# Altium schematic sheet MicroController.SchDoc
size A4; CompanyName: AUVIC; DrawnBy: Aman Nijjar; Organization: AUVIC; DocumentNumber: 2; Revision: 0; SheetNumber: 2; SheetTotal: 3; DocumentName: Pinger; ProjectName: Pinger
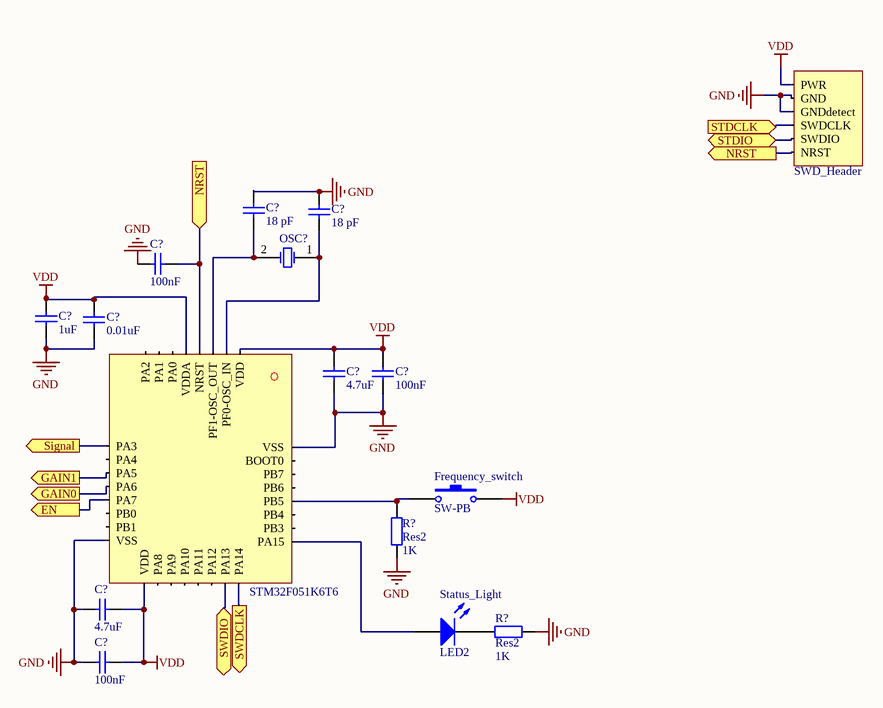
[diagram p0: MicroController.SchDoc]

## Parts
(Parts that share a designator on the sheet are numbered #1, #2 ... from top to bottom, then left to right.)
*?#1  SWD_Header  [Male_header]
*?#2  STM32F051K6T6  [TQFP68P900X900X160-32N]
C?#1  value 18 pF  [RAD-0.3]  (hidden comment: Cap)
C?#2  value 18 pF  [RAD-0.3]  (hidden comment: Cap)
C?#3  value 100nF  [RAD-0.3]  (hidden comment: Cap)
C?#4  value 1uF  [RAD-0.3]  (hidden comment: Cap)
C?#5  value 0.01uF  [RAD-0.3]  (hidden comment: Cap)
C?#6  value 4.7uF  [RAD-0.3]  (hidden comment: Cap)
C?#7  value 100nF  [RAD-0.3]  (hidden comment: Cap)
C?#8  value 4.7uF  [RAD-0.3]  (hidden comment: Cap)
C?#9  value 100nF  [RAD-0.3]  (hidden comment: Cap)
Frequency_switch  SW-PB  [SPST-2]
OSC?  ABMM2-14.7456MHZ-E2-T  [R38]  (value not drawn)
R?#1  Res2  value 1K  [AXIAL-0.4]
R?#2  Res2  value 1K  [AXIAL-0.4]
Status_Light  LED2  [3.2X1.6X1.1]

## Ports
EN (out), GAIN0 (out), GAIN1 (out), NRST (in), NRST (out), Signal (out), STDCLK (in), STDIO (bidir), SWDCLK (out), SWDIO (bidir)

## Nets
GND: *?#1.2(GND) *?#1.3(GNDdetect) *?#2.16(VSS) *?#2.32(VSS) C?#1.2 C?#2.2 C?#3.1 C?#4.2 C?#5.2 C?#6.2 C?#7.2 C?#8.2 C?#9.2 R?#1.2 R?#2.2
VDD: *?#1.1(PWR) *?#2.1(VDD) *?#2.5(VDDA) *?#2.17(VDD) C?#4.1 C?#5.1 C?#6.1 C?#7.1 C?#8.1 C?#9.1 Frequency_switch.2
EN: *?#2.13(PA7) ; port EN
GAIN0: *?#2.12(PA6) ; port GAIN0
GAIN1: *?#2.11(PA5) ; port GAIN1
NRST: *?#1.6(NRST) *?#2.4(NRST) C?#3.2 ; port NRST
Signal: *?#2.9(PA3) ; port Signal
STDCLK: *?#1.4(SWDCLK) ; port STDCLK
STDIO: *?#1.5(SWDIO) ; port STDIO
SWDCLK: *?#2.24(PA14) ; port SWDCLK
SWDIO: *?#2.23(PA13) ; port SWDIO
Net*?#2_2: *?#2.2(PF0-OSC_IN) C?#2.1 OSC?.1(OSC1)
Net*?#2_3: *?#2.3(PF1-OSC_OUT) C?#1.1 OSC?.2(OSC2)
Net*?#2_25: *?#2.25(PA15) Status_Light.1(A)
Net*?#2_28: *?#2.28(PB5) Frequency_switch.1 R?#1.1
NetR?#2_1: R?#2.1 Status_Light.2(K)

Not connected (* = marked no-connect by the designer): *?#2 6(PA0) 7(PA1) 8(PA2) 10(PA4) 14(PB0) 15(PB1) 18(PA8) 19(PA9) 20(PA10) 21(PA11) 22(PA12) 26(PB3) 27(PB4) 29(PB6) 30(PB7) 31(BOOT0)

## Library data of the parts
C?#1-C?#9 = Cap: Capacitor; Published: 8-Jun-2000; LatestRevisionDate: 17-Jul-2002; LatestRevisionNote: Re-released for DXP Platform.; PackageReference: RAD-0.3; Publisher: Altium Limited; PackageDescription: Radial Cap, Thru-Hole; 2 Leads; 0.3 in Pin Spacing
Frequency_switch = SW-PB: Switch; Published: 24-Mar-1999; LatestRevisionDate: 17-Jul-2002; LatestRevisionNote: Re-released for DXP Platform.; PackageReference: SPST-2; Publisher: Altium Limited; PackageDescription: Switch; 2 Leads
OSC? = XTAL: Crystal Oscillator; Published: 8-Jun-2000; LatestRevisionDate: 17-Jul-2002; LatestRevisionNote: Re-released for DXP Platform.; PackageReference: R38; Publisher: Altium Limited; PackageDescription: Crystal, Thru-Hole; 2 Leads; Body 3.1 x 8.2 mm (Dia.xH)
R?#1 R?#2 = Res2: Resistor; Published: 8-Jun-2000; LatestRevisionDate: 17-Jul-2002; LatestRevisionNote: Re-released for DXP Platform.; PackageReference: AXIAL-0.4; Publisher: Altium Limited; PackageDescription: Axial Device, Thru-Hole; 2 Leads; 0.4 in Pin Spacing
Status_Light = LED2: Typical RED, GREEN, YELLOW, AMBER GaAs LED; Published: 8-Jun-2000; LatestRevisionDate: 17-Jul-2002; LatestRevisionNote: Re-released for DXP Platform.; PackageVersion: Feb-2002; PackageReference: 3.2X1.6X1.1; Publisher: Altium Limited; PackageDescription: SM LED; 2 Flat Leads
*?#2 = STM32F051K6T6: Supplier 1: Mouser; Supplier Part Number 1: 511-STM32F051K6T6